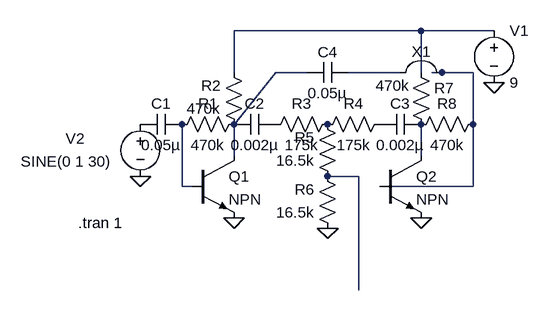
[diagram p0: schematic mosrutefuzz.asc]
mosrutefuzz.asc, the LTspice schematic file:
Version 4
SHEET 1 952 680
WIRE 656 -144 368 -144
WIRE 768 -144 656 -144
WIRE 368 -80 368 -144
WIRE 480 -80 432 -80
WIRE 624 -80 544 -80
WIRE 656 -80 656 -144
WIRE 688 -80 672 -80
WIRE 736 -80 688 -80
WIRE 368 0 432 -80
WIRE 736 0 736 -80
WIRE 368 48 368 0
WIRE 656 48 656 0
WIRE 560 80 512 80
WIRE 288 96 288 0
WIRE 304 96 288 96
WIRE 736 96 736 0
WIRE 736 96 592 96
WIRE 560 256 560 80
FLAG 656 144 0
FLAG 512 160 0
FLAG 368 144 0
FLAG 768 -64 0
FLAG 224 80 0
SYMBOL cap 288 -16 R90
WINDOW 0 0 32 VBottom 2
WINDOW 3 32 32 VTop 2
SYMATTR InstName C1
SYMATTR Value 0.05µ
SYMBOL res 384 -16 R90
WINDOW 0 0 56 VBottom 2
WINDOW 3 32 56 VTop 2
SYMATTR InstName R1
SYMATTR Value 470k
SYMBOL res 384 16 R180
WINDOW 0 36 76 Left 2
WINDOW 3 36 40 Left 2
SYMATTR InstName R2
SYMATTR Value 470k
SYMBOL cap 432 -16 R90
WINDOW 0 0 32 VBottom 2
WINDOW 3 32 32 VTop 2
SYMATTR InstName C2
SYMATTR Value 0.002µ
SYMBOL npn 304 48 R0
SYMATTR InstName Q1
SYMBOL res 528 -16 R90
WINDOW 0 0 56 VBottom 2
WINDOW 3 32 56 VTop 2
SYMATTR InstName R3
SYMATTR Value 175k
SYMBOL res 608 -16 R90
WINDOW 0 0 56 VBottom 2
WINDOW 3 32 56 VTop 2
SYMATTR InstName R4
SYMATTR Value 175k
SYMBOL res 528 96 R180
WINDOW 0 36 76 Left 2
WINDOW 3 36 40 Left 2
SYMATTR InstName R5
SYMATTR Value 16.5k
SYMBOL res 528 176 R180
WINDOW 0 36 76 Left 2
WINDOW 3 36 40 Left 2
SYMATTR InstName R6
SYMATTR Value 16.5k
SYMBOL cap 656 -16 R90
WINDOW 0 0 32 VBottom 2
WINDOW 3 32 32 VTop 2
SYMATTR InstName C3
SYMATTR Value 0.002µ
SYMBOL cap 544 -96 R90
WINDOW 0 0 32 VBottom 2
WINDOW 3 32 32 VTop 2
SYMATTR InstName C4
SYMATTR Value 0.05µ
SYMBOL res 640 -96 R0
WINDOW 3 -54 36 Left 2
SYMATTR InstName R7
SYMATTR Value 470k
SYMBOL res 752 -16 R90
WINDOW 0 0 56 VBottom 2
WINDOW 3 32 56 VTop 2
SYMATTR InstName R8
SYMATTR Value 470k
SYMBOL Misc\\jumper 656 -144 R0
SYMATTR InstName X1
SYMBOL voltage 768 -160 R0
WINDOW 123 0 0 Left 0
WINDOW 39 0 0 Left 0
SYMATTR InstName V1
SYMATTR Value 9
SYMBOL voltage 224 -16 R0
WINDOW 0 -115 38 Left 2
WINDOW 3 -184 73 Left 2
WINDOW 123 0 0 Left 0
WINDOW 39 0 0 Left 0
SYMATTR InstName V2
SYMATTR Value SINE(0 1 30)
SYMBOL npn 592 48 R0
SYMATTR InstName Q2
TEXT 128 152 Left 2 !.tran 1

The netlist it stands for:
* mosrutefuzz.asc
C1 N006 P001 0.05µ
R1 N002 N006 470k
R2 N002 N001 470k
C2 P002 N002 0.002µ
Q1 N002 N006 0 0 NPN
R3 P003 P002 175k
R4 P004 P003 175k
R5 N005 P003 16.5k
R6 0 N005 16.5k
C3 N004 P004 0.002µ
C4 N003 N002 0.05µ
R7 N001 N004 470k
R8 N003 N004 470k
V1 N001 0 9
V2 P001 0 SINE(0 1 30)
Q2 N004 N003 0 0 NPN
.model NPN NPN
.model PNP PNP
.lib standard.bjt
.tran 1
.backanno
.end